# Altium schematic sheet 剥皮器20200614.SCHDOC
size A2; PageSetup: Record=PageOptions|CenterHorizontal=True|CenterVertical=True|PrintScale=1.02|XCorrection=1.00|YCorrection=1.00|PrintKind=0|BorderSize=5000000|LeftOffset=0|BottomOffset=0|Orientation=2|PaperLength=1000|PaperWidth=1000|Scale=100|PaperSource=7|PrintQuality=-4|MediaType=1|DitherType=10|PaperKind=A3|PrintScaleMode=1
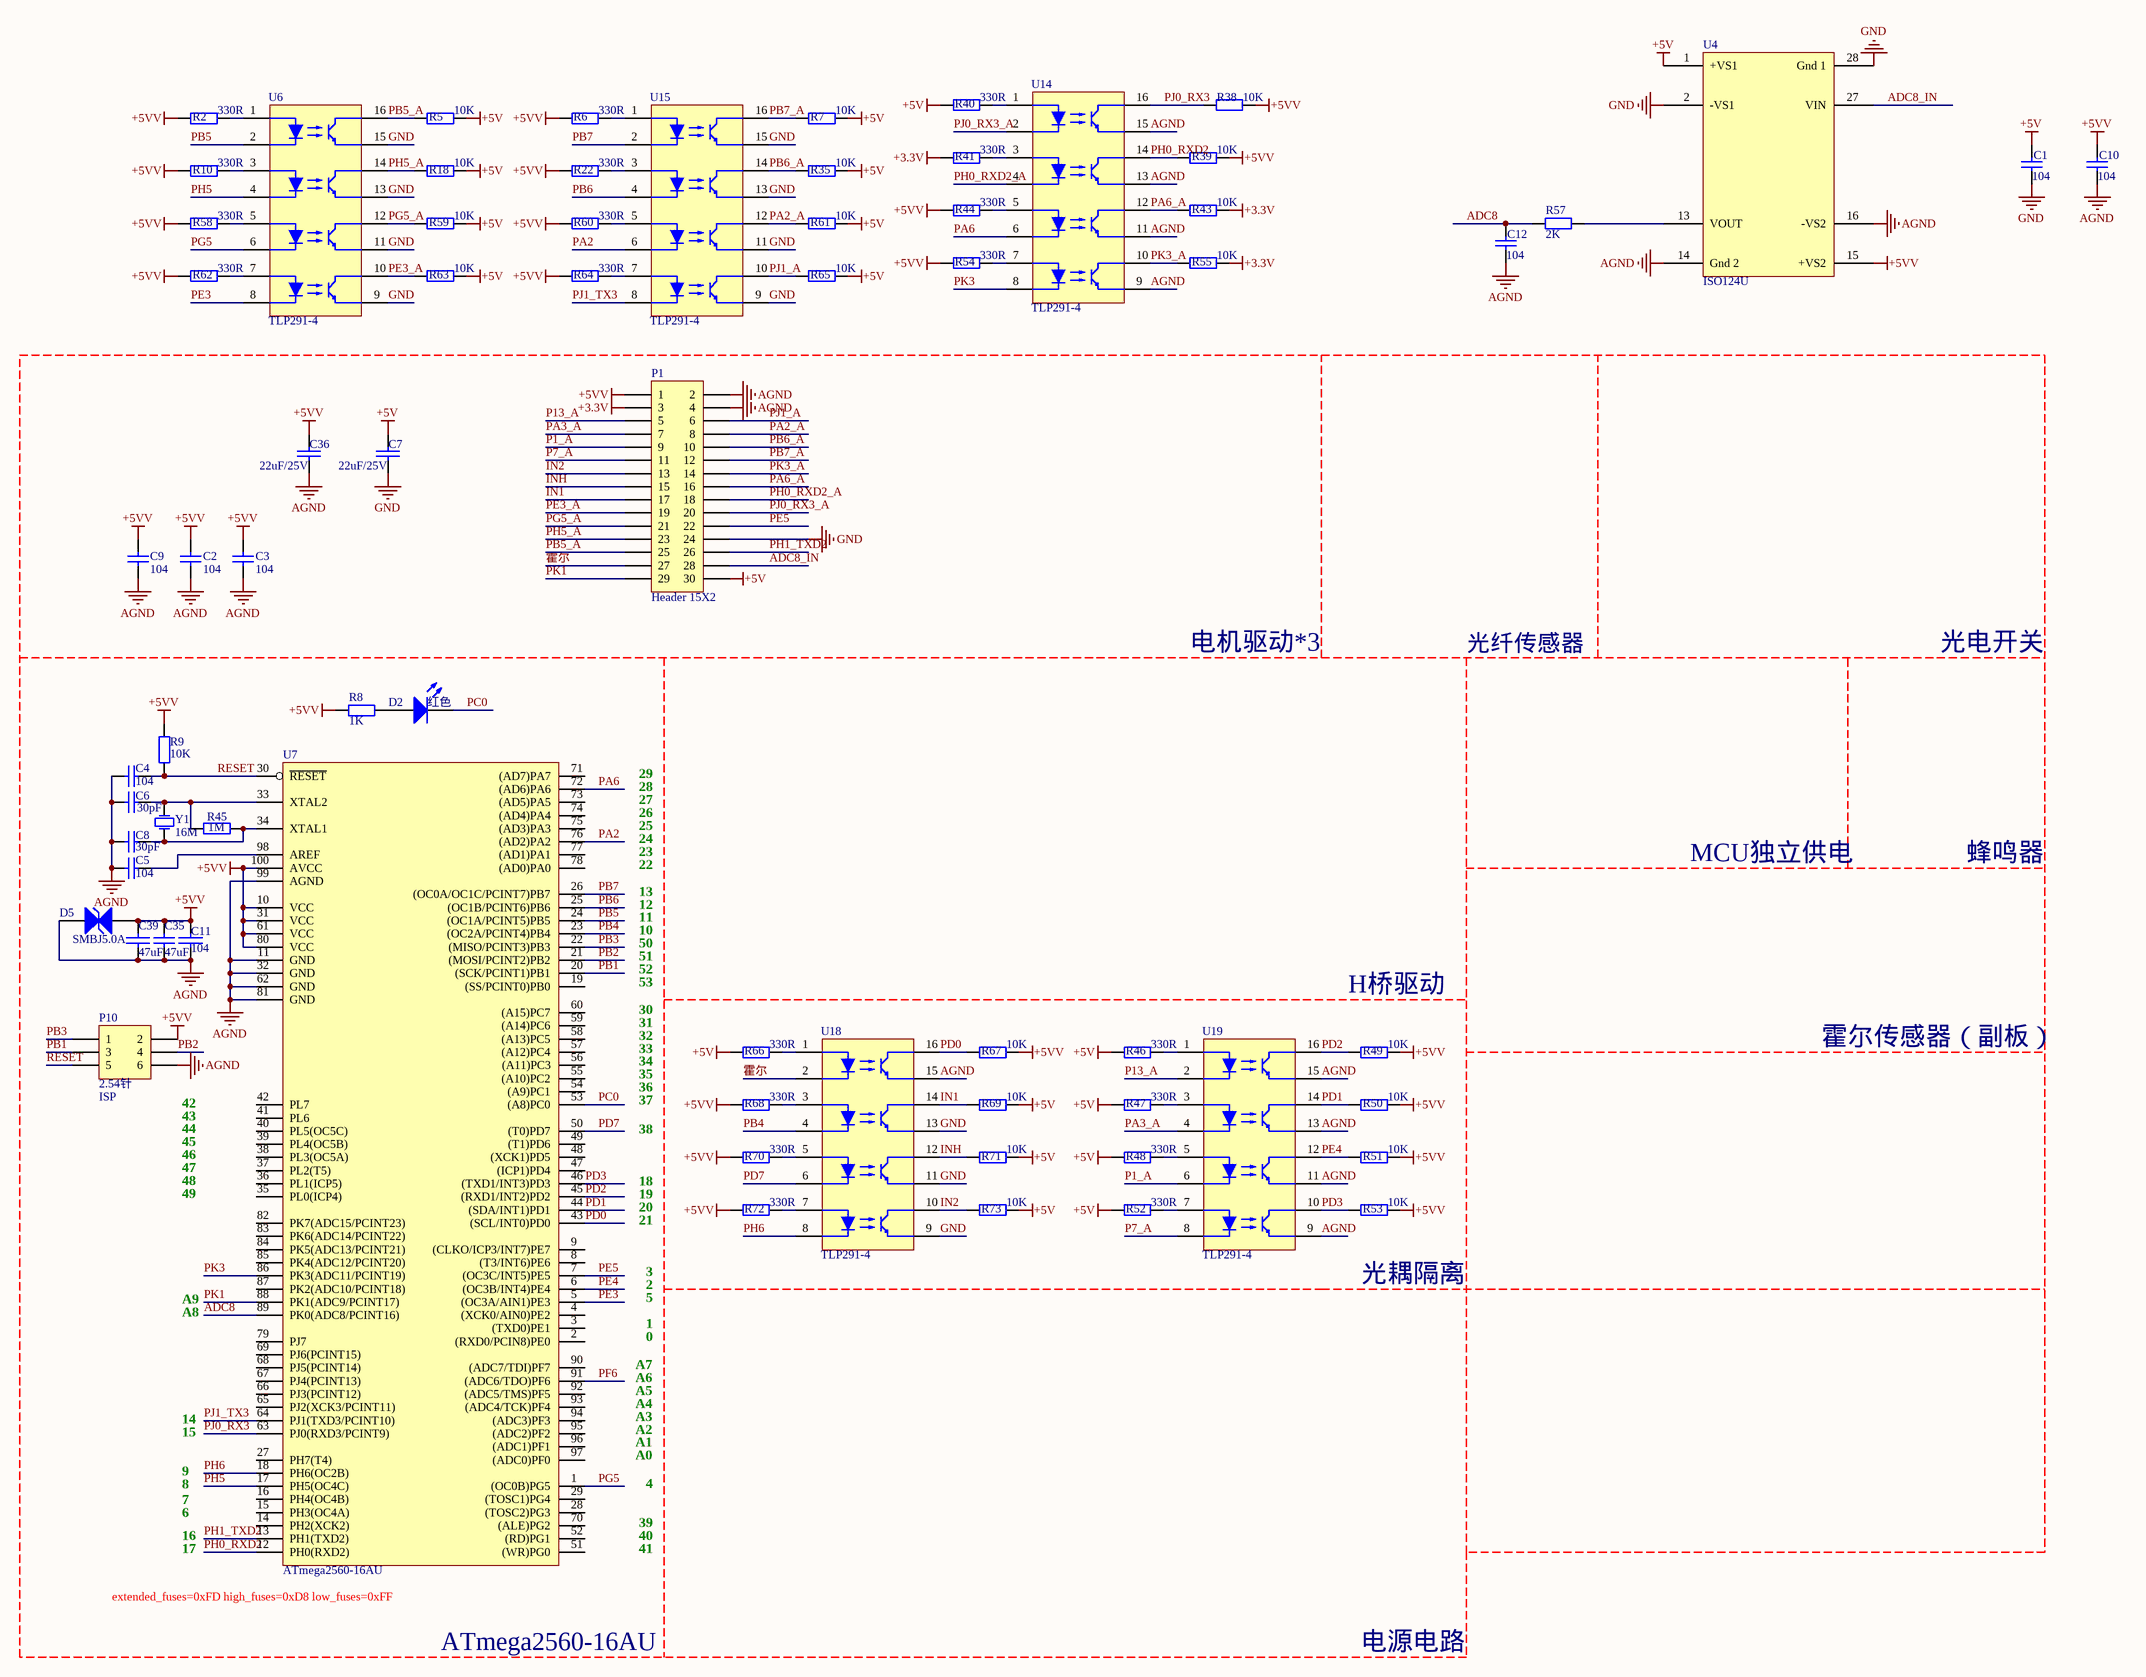
[diagram p0: 剥皮器20200614.SCHDOC]

## Parts
C1  104  [0805-C]
C2  104  [0805-C]
C3  104  [0805-C]
C4  104  [0805-C]
C5  104  [0805-C]
C6  30pF  [0805-C]
C7  22uF/25V  [1206C]
C8  30pF  [0805-C]
C9  104  [0805-C]
C10  104  [0805-C]
C11  104  [0805-C]
C12  104  [0805-C]
C35  47uF  [0805-C]
C36  22uF/25V  [1206C]
C39  47uF  [0805-C]
D2  红色  [0805-LED]
D5  SMBJ5.0A  [LC-SMB(DO-214AA)_S2]
P1  Header 15X2  [SIP15-1.27]
P10  2.54针  [HDR2X3]
R2  330R  [0805-R]
R5  10K  [0805-R]
R6  330R  [0805-R]
R7  10K  [0805-R]
R8  1K  [0805-R]
R9  10K  [0805-R]
R10  330R  [0805-R]
R18  10K  [0805-R]
R22  330R  [0805-R]
R35  10K  [0805-R]
R38  10K  [0805-R]
R39  10K  [0805-R]
R40  330R  [0805-R]
R41  330R  [0805-R]
R43  10K  [0805-R]
R44  330R  [0805-R]
R45  1M  [0805-R]
R46  330R  [0805-R]
R47  330R  [0805-R]
R48  330R  [0805-R]
R49  10K  [0805-R]
R50  10K  [0805-R]
R51  10K  [0805-R]
R52  330R  [0805-R]
R53  10K  [0805-R]
R54  330R  [0805-R]
R55  10K  [0805-R]
R57  2K  [0805-R]
R58  330R  [0805-R]
R59  10K  [0805-R]
R60  330R  [0805-R]
R61  10K  [0805-R]
R62  330R  [0805-R]
R63  10K  [0805-R]
R64  330R  [0805-R]
R65  10K  [0805-R]
R66  330R  [0805-R]
R67  10K  [0805-R]
R68  330R  [0805-R]
R69  10K  [0805-R]
R70  330R  [0805-R]
R71  10K  [0805-R]
R72  330R  [0805-R]
R73  10K  [0805-R]
U4  ISO124U  [SOIC127P1030X265-8]
U6  TLP291-4  [TLP291-4]
U7  ATmega2560-16AU  [LC-LQFP-100_14x14x05P]
U14  TLP291-4  [TLP291-4]
U15  TLP291-4  [TLP291-4]
U18  TLP291-4  [TLP291-4]
U19  TLP291-4  [TLP291-4]
Y1  16M  [LC-SMD-5032_2P]

## Nets
+3.3V: P1.3 R41.2 R43.1 R55.1
+5V: C1.2 C7.1 P1.30 R5.1 R7.1 R18.1 R35.1 R40.2 R46.2 R47.2 R48.2 R52.2 R59.1 R61.1 R63.1 R65.1 R66.2 R69.1 R71.1 R73.1 U4.1(+VS1)
+5VV: C2.1 C3.1 C9.1 C10.2 C11.1 C35.2 C36.1 C39.2 D5.1(A) P1.1 P10.2 R2.2 R6.2 R8.2 R9.2 R10.2 R22.2 R38.1 R39.1 R44.2 R49.1 R50.1 R51.1 R53.1 R54.2 R58.2 R60.2 R62.2 R64.2 R67.1 R68.2 R70.2 R72.2 U4.15(+VS2) U7.10(VCC) U7.31(VCC) U7.61(VCC) U7.80(VCC) U7.100(AVCC)
AGND: C2.2 C3.2 C4.2 C5.2 C6.2 C8.2 C9.2 C10.1 C11.2 C12.1 C35.1 C36.2 C39.1 D5.2(K) P1.2 P1.4 P10.6 U4.14(Gnd_2) U4.16(-VS2) U7.11(GND) U7.32(GND) U7.62(GND) U7.81(GND) U7.99(AGND) U14.9(Emitter4) U14.11(Emitter3) U14.13(Emitter2) U14.15(Emitter1) U18.15(Emitter1) U19.9(Emitter4) U19.11(Emitter3) U19.13(Emitter2) U19.15(Emitter1)
GND: C1.1 C7.2 P1.24 U4.2(-VS1) U4.28(Gnd_1) U6.9(Emitter4) U6.11(Emitter3) U6.13(Emitter2) U6.15(Emitter1) U15.9(Emitter4) U15.11(Emitter3) U15.13(Emitter2) U15.15(Emitter1) U18.9(Emitter4) U18.11(Emitter3) U18.13(Emitter2)
ADC8: C12.2 R57.2 U7.89(PK0(ADC8/PCINT16))
ADC8_IN: P1.28 U4.27(VIN)
IN1: P1.17 R69.2 U18.14(Collector2)
IN2: P1.13 R73.2 U18.10(Collector4)
INH: P1.15 R71.2 U18.12(Collector3)
P1_A: P1.9 U19.6(Cathode3)
P7_A: P1.11 U19.8(Cathode4)
P13_A: P1.5 U19.2(Cathode1)
PA2: U7.76((AD2)PA2) U15.6(Cathode3)
PA2_A: P1.8 R61.2 U15.12(Collector3)
PA3_A: P1.7 U19.4(Cathode2)
PA6: U7.72((AD6)PA6) U14.6(Cathode3)
PA6_A: P1.16 R43.2 U14.12(Collector3)
PB1: P10.3 U7.20((SCK/PCINT1)PB1)
PB2: P10.4 U7.21((MOSI/PCINT2)PB2)
PB3: P10.1 U7.22((MISO/PCINT3)PB3)
PB4: U7.23((OC2A/PCINT4)PB4) U18.4(Cathode2)
PB5: U6.2(Cathode1) U7.24((OC1A/PCINT5)PB5)
PB5_A: P1.25 R5.2 U6.16(Collector1)
PB6: U7.25((OC1B/PCINT6)PB6) U15.4(Cathode2)
PB6_A: P1.10 R35.2 U15.14(Collector2)
PB7: U7.26((OC0A/OC1C/PCINT7)PB7) U15.2(Cathode1)
PB7_A: P1.12 R7.2 U15.16(Collector1)
PC0: D2.2(K) U7.53((A8)PC0)
PD0: R67.2 U7.43((SCL/INT0)PD0) U18.16(Collector1)
PD1: R50.2 U7.44((SDA/INT1)PD1) U19.14(Collector2)
PD2: R49.2 U7.45((RXD1/INT2)PD2) U19.16(Collector1)
PD3: R53.2 U7.46((TXD1/INT3)PD3) U19.10(Collector4)
PD7: U7.50((T0)PD7) U18.6(Cathode3)
PE3: U6.8(Cathode4) U7.5((OC3A/AIN1)PE3)
PE3_A: P1.19 R63.2 U6.10(Collector4)
PE4: R51.2 U7.6((OC3B/INT4)PE4) U19.12(Collector3)
PE5: P1.22 U7.7((OC3C/INT5)PE5)
PF6: U7.91((ADC6/TDO)PF6)
PG5: U6.6(Cathode3) U7.1((OC0B)PG5)
PG5_A: P1.21 R59.2 U6.12(Collector3)
PH0_RXD2: R39.2 U7.12(PH0(RXD2)) U14.14(Collector2)
PH0_RXD2_A: P1.18 U14.4(Cathode2)
PH1_TXD2: P1.26 U7.13(PH1(TXD2))
PH5: U6.4(Cathode2) U7.17(PH5(OC4C))
PH5_A: P1.23 R18.2 U6.14(Collector2)
PH6: U7.18(PH6(OC2B)) U18.8(Cathode4)
PJ0_RX3: R38.2 U7.63(PJ0(RXD3/PCINT9)) U14.16(Collector1)
PJ0_RX3_A: P1.20 U14.2(Cathode1)
PJ1_A: P1.6 R65.2 U15.10(Collector4)
PJ1_TX3: U7.64(PJ1(TXD3/PCINT10)) U15.8(Cathode4)
PK1: P1.29 U7.88(PK1(ADC9/PCINT17))
PK3: U7.86(PK3(ADC11/PCINT19)) U14.8(Cathode4)
PK3_A: P1.14 R55.2 U14.10(Collector4)
RESET: C4.1 P10.5 R9.1 U7.30(~{RESET})
霍尔: P1.27 U18.2(Cathode1)
NetC5_1: C5.1 U7.98(AREF)
NetC6_1: C6.1 R45.1 U7.33(XTAL2) Y1.1(OSC1)
NetC8_1: C8.1 R45.2 U7.34(XTAL1) Y1.2(OSC2)
NetD2_1: D2.1(A) R8.1
NetR2_1: R2.1 U6.1(Anode1)
NetR6_1: R6.1 U15.1(Anode1)
NetR10_1: R10.1 U6.3(Anode2)
NetR22_1: R22.1 U15.3(Anode2)
NetR40_1: R40.1 U14.1(Anode1)
NetR41_1: R41.1 U14.3(Anode2)
NetR44_1: R44.1 U14.5(Anode3)
NetR46_1: R46.1 U19.1(Anode1)
NetR47_1: R47.1 U19.3(Anode2)
NetR48_1: R48.1 U19.5(Anode3)
NetR52_1: R52.1 U19.7(Anode4)
NetR54_1: R54.1 U14.7(Anode4)
NetR57_1: R57.1 U4.13(VOUT)
NetR58_1: R58.1 U6.5(Anode3)
NetR60_1: R60.1 U15.5(Anode3)
NetR62_1: R62.1 U6.7(Anode4)
NetR64_1: R64.1 U15.7(Anode4)
NetR66_1: R66.1 U18.1(Anode1)
NetR68_1: R68.1 U18.3(Anode2)
NetR70_1: R70.1 U18.5(Anode3)
NetR72_1: R72.1 U18.7(Anode4)

Not connected (* = marked no-connect by the designer): U7 2((RXD0/PCIN8)PE0) 3((TXD0)PE1) 4((XCK0/AIN0)PE2) 8((T3/INT6)PE6) 9((CLKO/ICP3/INT7)PE7) 14(PH2(XCK2)) 15(PH3(OC4A)) 16(PH4(OC4B)) 19((SS/PCINT0)PB0) 27(PH7(T4)) 28((TOSC2)PG3) 29((TOSC1)PG4) 35(PL0(ICP4)) 36(PL1(ICP5)) 37(PL2(T5)) 38(PL3(OC5A)) 39(PL4(OC5B)) 40(PL5(OC5C)) 41(PL6) 42(PL7) 47((ICP1)PD4) 48((XCK1)PD5) 49((T1)PD6) 51((WR)PG0) 52((RD)PG1) 54((A9)PC1) 55((A10)PC2) 56((A11)PC3) 57((A12)PC4) 58((A13)PC5) 59((A14)PC6) 60((A15)PC7) 65(PJ2(XCK3/PCINT11)) 66(PJ3(PCINT12)) 67(PJ4(PCINT13)) 68(PJ5(PCINT14)) 69(PJ6(PCINT15)) 70((ALE)PG2) 71((AD7)PA7) 73((AD5)PA5) 74((AD4)PA4) 75((AD3)PA3) 77((AD1)PA1) 78((AD0)PA0) 79(PJ7) 82(PK7(ADC15/PCINT23)) 83(PK6(ADC14/PCINT22)) 84(PK5(ADC13/PCINT21)) 85(PK4(ADC12/PCINT20)) 87(PK2(ADC10/PCINT18)) 90((ADC7/TDI)PF7) 92((ADC5/TMS)PF5) 93((ADC4/TCK)PF4) 94((ADC3)PF3) 95((ADC2)PF2) 96((ADC1)PF1) 97((ADC0)PF0)

## Notes on the sheet
- 电机驱动*3
- 光纤传感器
- 光电开关
- 27
- 28
- 29
- 22
- 23
- 24
- 25
- 26
- MCU独立供电
- 蜂鸣器
- 10
- 11
- 12
- 13
- 53
- 52
- 51
- 50
- H桥驱动
- 34
- 33
- 32
- 31
- 30
- 霍尔传感器（副板）
- (near P10) 42
- 43
- 37
- 36
- 35
- 44
- 45
- 46
- 47
- 48
- 49
- 19
- 18
- 38
- 21
- 20
- A8
- A9
- 1
- 5
- 2
- 3
- 光耦隔离
- A5
- A6
- A7
- 0
- 14
- 15
- A0
- A1
- A2
- A3
- A4
- 9
- 8
- 7
- 6
- 39
- 4
- 16
- 17
- 40
- 41
- (near U7) extended_fuses=0xFD high_fuses=0xD8 low_fuses=0xFF
- ATmega2560-16AU
- 电源电路
- (in symbol Header 3X2) ISP

## Library data of the parts
C1-C5 C8-C10 C12 C35 = Cap: Capacitor; Published: 8-Jun-2000; LatestRevisionDate: 17-Jul-2002; LatestRevisionNote: Re-released for DXP Platform.; Publisher: Altium Limited
  C1 C4 C10 C12 C35: PackageReference: RAD-0.3
C6 = Cap: Capacitor; Value: 30P; Published: 8-Jun-2000; LatestRevisionDate: 17-Jul-2002; LatestRevisionNote: Re-released for DXP Platform.; Publisher: Altium Limited
C7 C11 C36 C39 = CAP: Capacitor
D2 = LED0: Typical INFRARED GaAs LED; Published: 8-Jun-2000; LatestRevisionDate: 08-Jul-2005; LatestRevisionNote: Mech Layer 1 removed.; PackageReference: LED-0; Publisher: Altium Limited
D5 = TVS
P1 = Header 15X2: Header, 15-Pin, Dual row; LatestRevisionDate: 17-Jul-2002; LatestRevisionNote: Re-released for DXP Platform.; Publisher: Altium Limited
P10 = Header 3X2: Header, 3-Pin, Dual row; LatestRevisionDate: 17-Jul-2002; LatestRevisionNote: Re-released for DXP Platform.; Publisher: Altium Limited
R2 R5-R7 R9 R10 R18 R22 R35 R38-R41 R43-R55 R58-R73 = Res2: Resistor; Published: 8-Jun-2000; LatestRevisionDate: 17-Jul-2002; LatestRevisionNote: Re-released for DXP Platform.; PackageReference: AXIAL-0.4; Publisher: Altium Limited
  R9: Value: 10K
R8 R57 = Res2: Resistor; Value: 10K; Published: 8-Jun-2000; LatestRevisionDate: 17-Jul-2002; LatestRevisionNote: Re-released for DXP Platform.; PackageReference: AXIAL-0.4; Publisher: Altium Limited
U6 U14 U15 U18 U19 = TLP291-4: Photocouplers GaAs Infrared LED & Photo Transistor
U7 = Arduino MEGA 2560
Y1 = XTAL: Crystal Oscillator; Published: 8-Jun-2000; LatestRevisionDate: 17-Jul-2002; LatestRevisionNote: Re-released for DXP Platform.; Publisher: Altium Limited